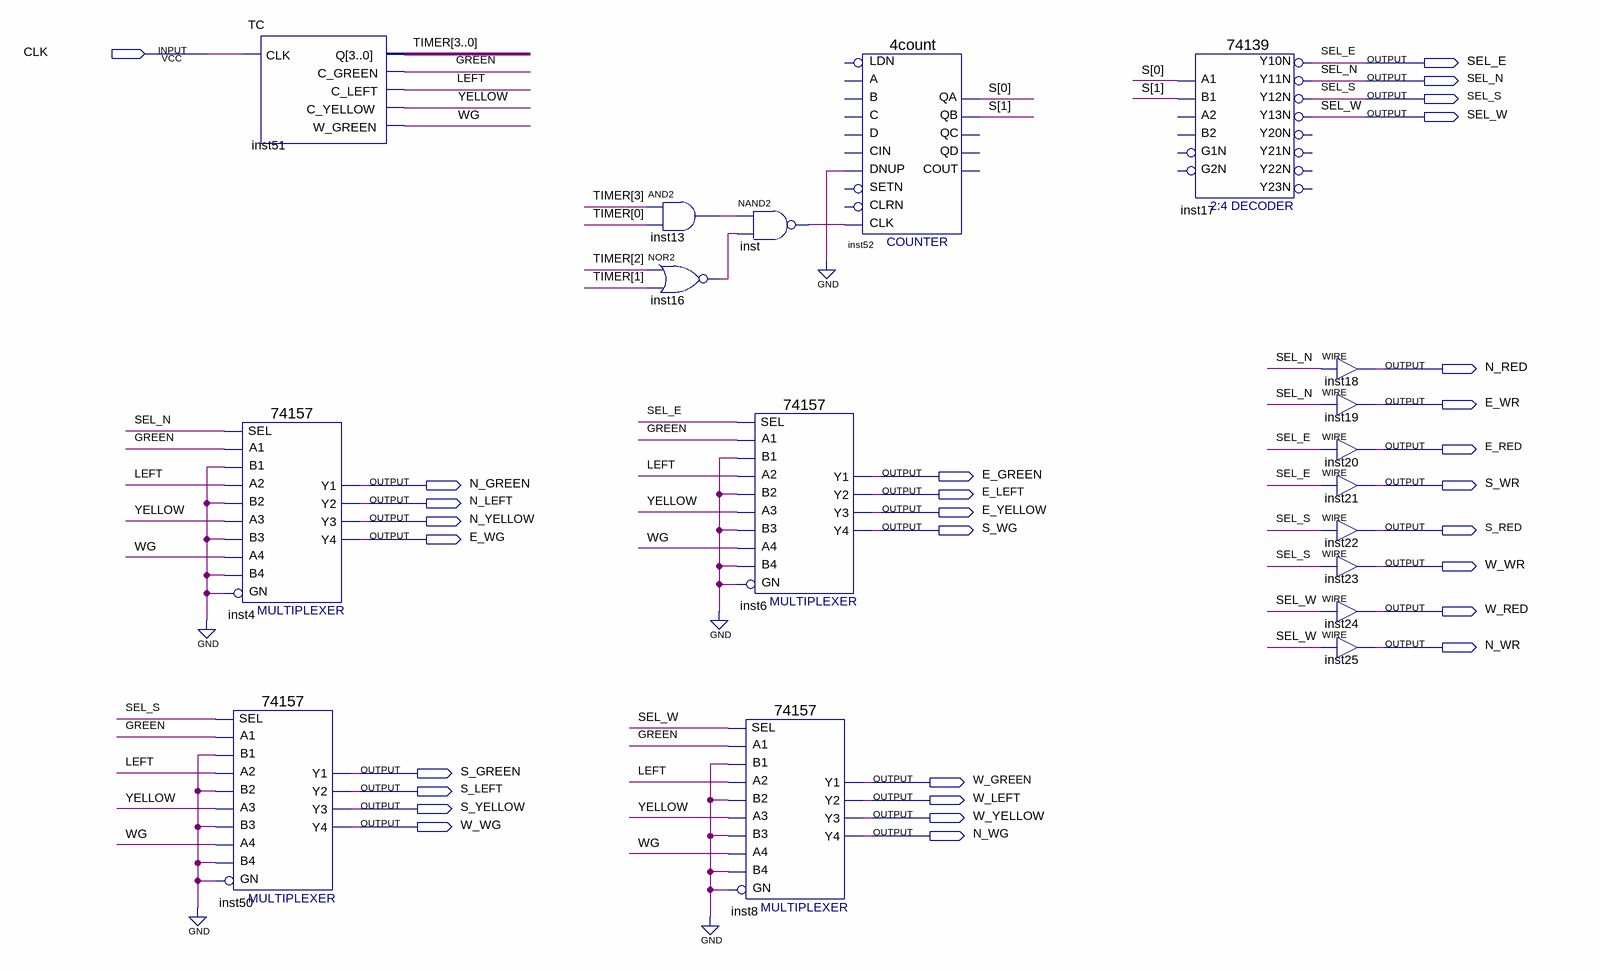
[diagram p0: schematic sheet]
// Quartus schematic TRAFFIC.bdf as structural Verilog: 18 symbols, 29 pins
module TRAFFIC (
  input  CLK,
  output SEL_E,
  output SEL_N,
  output SEL_S,
  output SEL_W,
  output N_RED,
  output E_WR,
  output E_RED,
  output E_GREEN,
  output N_GREEN,
  output S_WR,
  output E_LEFT,
  output N_LEFT,
  output E_YELLOW,
  output N_YELLOW,
  output S_WG,
  output S_RED,
  output E_WG,
  output W_WR,
  output W_RED,
  output N_WR,
  output S_GREEN,
  output W_GREEN,
  output S_LEFT,
  output W_LEFT,
  output S_YELLOW,
  output W_YELLOW,
  output W_WG,
  output N_WG
);

  wire GREEN, inst13_out, inst16_out, inst_out, LEFT, WG, YELLOW;
  wire [1:0] S;
  wire [3:0] TIMER;

  TC inst51 (.CLK(CLK), .Q(TIMER), .C_GREEN(GREEN), .C_LEFT(LEFT), .C_YELLOW(YELLOW), .W_GREEN(WG));
  \74157  inst4 (
    .A1(GREEN), .B1(1'b0), .SEL(SEL_N), .B2(1'b0), .A3(YELLOW), .B3(1'b0), .A2(LEFT), .B4(1'b0), .GN(1'b0),
    .A4(WG), .Y2(N_LEFT), .Y1(N_GREEN), .Y4(E_WG), .Y3(N_YELLOW));
  \74157  inst50 (
    .A1(GREEN), .B1(1'b0), .SEL(SEL_S), .B2(1'b0), .A3(YELLOW), .B3(1'b0), .A2(LEFT), .B4(1'b0), .GN(1'b0),
    .A4(WG), .Y2(S_LEFT), .Y1(S_GREEN), .Y4(W_WG), .Y3(S_YELLOW));
  and inst13 (inst13_out, TIMER[3], TIMER[0]);
  nor inst16 (inst16_out, TIMER[2], TIMER[1]);
  nand inst (inst_out, inst13_out, inst16_out);
  \74157  inst6 (
    .A1(GREEN), .B1(1'b0), .SEL(SEL_E), .B2(1'b0), .A3(YELLOW), .B3(1'b0), .A2(LEFT), .B4(1'b0), .GN(1'b0),
    .A4(WG), .Y2(E_LEFT), .Y1(E_GREEN), .Y4(S_WG), .Y3(E_YELLOW));
  \74157  inst8 (
    .A1(GREEN), .B1(1'b0), .SEL(SEL_W), .B2(1'b0), .A3(YELLOW), .B3(1'b0), .A2(LEFT), .B4(1'b0), .GN(1'b0),
    .A4(WG), .Y2(W_LEFT), .Y1(W_GREEN), .Y4(N_WG), .Y3(W_YELLOW));
  \4count  inst52 (
    .DNUP(1'b0), .CLK(inst_out), .QA(S[0]), .QB(S[1]));  // open: LDN, B, A, D, CIN, SETN, C, CLRN, QC, QD, COUT
  \74139  inst17 (
    .A1(S[0]), .B1(S[1]), .Y10N(SEL_E), .Y13N(SEL_W), .Y12N(SEL_S), .Y11N(SEL_N));  // open: A2, B2, G1N, G2N, Y20N, Y21N, Y22N, Y23N
  assign N_RED = SEL_N;  // WIRE inst18
  assign E_WR = SEL_N;  // WIRE inst19
  assign E_RED = SEL_E;  // WIRE inst20
  assign S_WR = SEL_E;  // WIRE inst21
  assign S_RED = SEL_S;  // WIRE inst22
  assign W_WR = SEL_S;  // WIRE inst23
  assign W_RED = SEL_W;  // WIRE inst24
  assign N_WR = SEL_W;  // WIRE inst25
endmodule
